# EAGLE design Moodlight20_ETP2 (EAGLE 9.5.0)

## Sheet 1 of 2
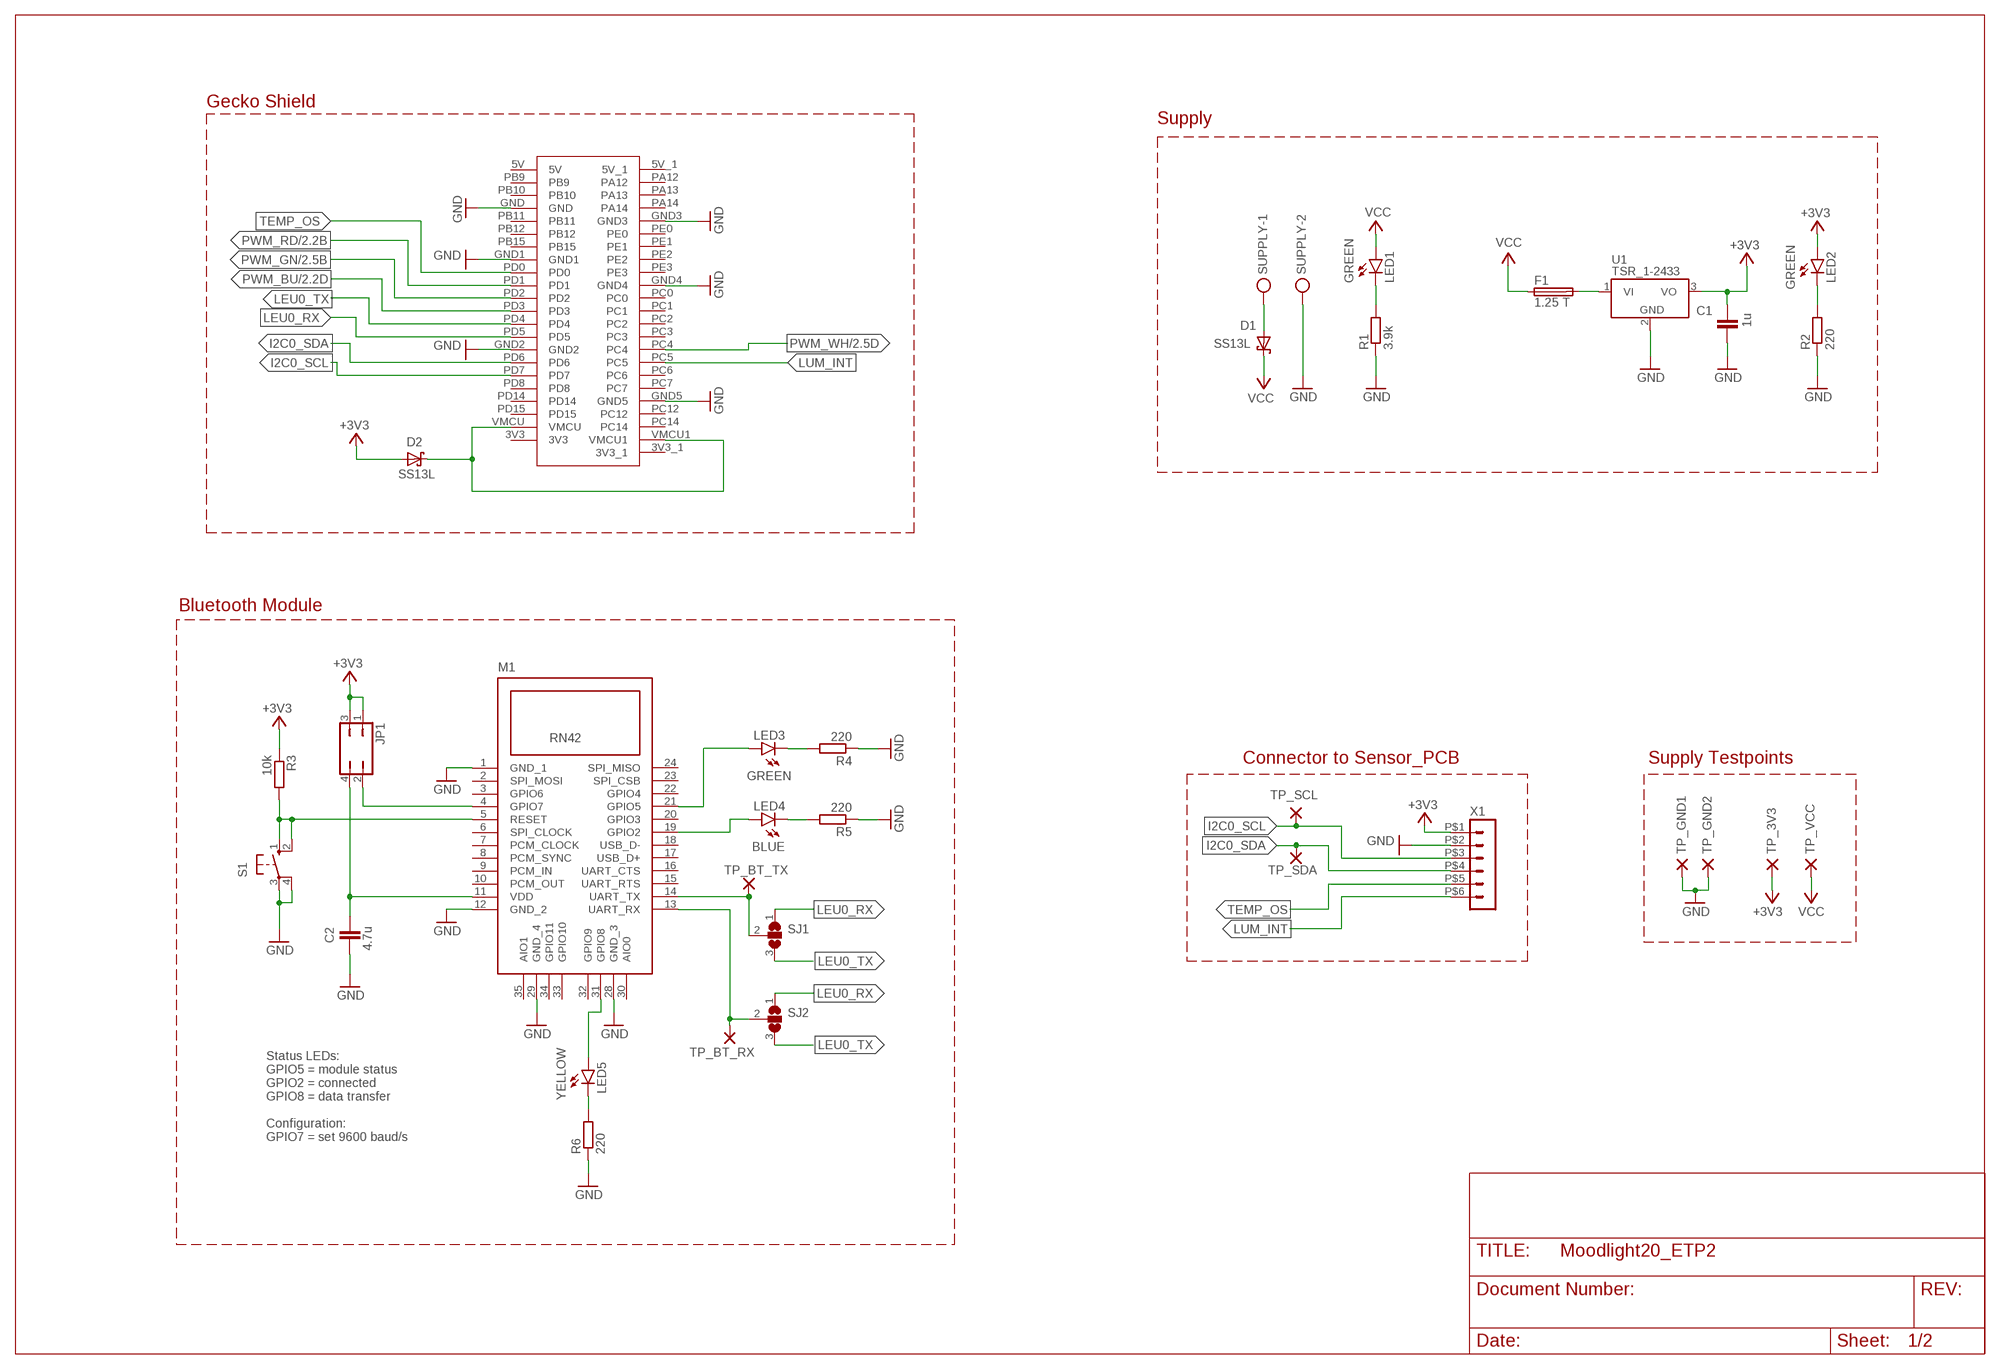
[diagram p0: schematic, sheet 1]

### Parts
C1  1u  C-EUC0805K  [C0805K]
C2  4.7u  C-EUC0805K  [C0805K]
D1  SS13L  [SUB-SMA]
D2  SS13L  [SUB-SMA]
F1  1.25 T  19560  [19560]
GECKO  GECKO_SHIELD  [GECKO_SHIELD]
JP1  JP2Q  [JP2Q]
LED1  GREEN  LEDCHIP-LED0805  [CHIP-LED0805]
LED2  GREEN  LEDCHIP-LED0805  [CHIP-LED0805]
LED3  GREEN  LEDCHIP-LED0805  [CHIP-LED0805]
LED4  BLUE  LEDCHIP-LED0805  [CHIP-LED0805]
LED5  YELLOW  LEDCHIP-LED0805  [CHIP-LED0805]
M1  RN42_BLUETOOTH  [RN42_BLUETOOTH]
R1  3.9k  R-EU_R0805  [R0805]
R2  220  R-EU_R0805  [R0805]
R3  10k  R-EU_R0805  [R0805]
R4  220  R-EU_R0805  [R0805]
R5  220  R-EU_R0805  [R0805]
R6  220  R-EU_R0805  [R0805]
S1  10-XX  [B3F-10XX]
SJ1  SJ2W  [SJ_2]
SJ2  SJ2W  [SJ_2]
SUPPLY  MKDSN1,5/2-5,08  [MKDSN1,5/2-5,08]
TP_3V3  TESTPOINT  [3,2/1,6]
TP_BT_RX  TESTPOINT  [3,2/1,6]
TP_BT_TX  TESTPOINT  [3,2/1,6]
TP_GND1  TESTPOINT  [3,2/1,6]
TP_GND2  TESTPOINT  [3,2/1,6]
TP_SCL  TESTPOINT  [3,2/1,6]
TP_SDA  TESTPOINT  [3,2/1,6]
TP_VCC  TESTPOINT  [3,2/1,6]
U1  TSR_1-2433  [TSR-1]
X1  HEADER_POS6_43045-0612  [43045-0612]

### Nets
+3V3: C1.1 D2.A JP1.1 JP1.3 LED2.A R3.1 TP_3V3.1(P) U1.3(VO) X1.P$1
A1: D1.A SUPPLY.1
GND: C1.2 C2.1 GECKO.GND GECKO.GND1 GECKO.GND2 GECKO.GND3 GECKO.GND4 GECKO.GND5 M1.1(GND_1) M1.12(GND_2) M1.28(GND_3) M1.29(GND_4) R1.1 R2.1 R4.1 R5.1 R6.1 S1.3(P) S1.4(P1) SUPPLY.2 TP_GND1.1(P) TP_GND2.1(P) U1.2(GND) X1.P$2 ; also sheet 2
I2C0_SCL: GECKO.PD7 TP_SCL.1(P) X1.P$3
I2C0_SDA: GECKO.PD6 TP_SDA.1(P) X1.P$4
LEU0_RX: GECKO.PD5 SJ1.1 SJ2.1
LEU0_TX: GECKO.PD4 SJ1.3 SJ2.3
LUM_INT: GECKO.PC5 X1.P$6
N$1: LED2.C R2.2
N$2: D2.C GECKO.VMCU GECKO.VMCU1
N$7: LED1.C R1.2
N$13: JP1.2 M1.4(GPIO7)
N$14: C2.2 JP1.4 M1.11(VDD)
N$22: LED4.C R5.2
N$23: LED4.A M1.19(GPIO2)
N$24: LED3.C R4.2
N$25: LED3.A M1.21(GPIO5)
N$26: LED5.C R6.2
N$27: LED5.A M1.31(GPIO8)
N$28: M1.5(RESET) R3.2 S1.1(S) S1.2(S1)
N$29: M1.14(UART_TX) SJ1.2 TP_BT_TX.1(P)
N$30: M1.13(UART_RX) SJ2.2 TP_BT_RX.1(P)
PWM_BU: GECKO.PD3 ; also sheet 2
PWM_GN: GECKO.PD2 ; also sheet 2
PWM_RD: GECKO.PD1 ; also sheet 2
PWM_WH: GECKO.PC4 ; also sheet 2
TEMP_OS: GECKO.PD0 X1.P$5
VCC: D1.C F1.1 LED1.A TP_VCC.1(P) ; also sheet 2
VI: F1.2 U1.1(VI)
Unconnected: GECKO.3V3 GECKO.3V3_1 GECKO.5V GECKO.5V_1 GECKO.PA12 GECKO.PA13 GECKO.PA14 GECKO.PB9 GECKO.PB10 GECKO.PB11 GECKO.PB12 GECKO.PB15 GECKO.PC0 GECKO.PC1 GECKO.PC2 GECKO.PC3 GECKO.PC6 GECKO.PC7 GECKO.PC12 GECKO.PC14 GECKO.PD8 GECKO.PD14 GECKO.PD15 GECKO.PE0 GECKO.PE1 GECKO.PE2 GECKO.PE3 M1.2(SPI_MOSI) M1.3(GPIO6) M1.6(SPI_CLOCK) M1.7(PCM_CLOCK) M1.8(PCM_SYNC) M1.9(PCM_IN) M1.10(PCM_OUT) M1.15(UART_RTS) M1.16(UART_CTS) M1.17(USB_D+) M1.18(USB_D-) M1.20(GPIO3) M1.22(GPIO4) M1.23(SPI_CSB) M1.24(SPI_MISO) M1.30(AIO0) M1.32(GPIO9) M1.33(GPIO10) M1.34(GPIO11) M1.35(AIO1)

### Notes on the sheet
- Gecko Shield
- Supply
- Bluetooth Module
- Connector to Sensor_PCB | Supply Testpoints
- Status LEDs:
  GPIO5 = module status
  GPIO2 = connected
  GPIO8 = data transfer
  
  Configuration:
  GPIO7 = set 9600 baud/s

## Sheet 2 of 2
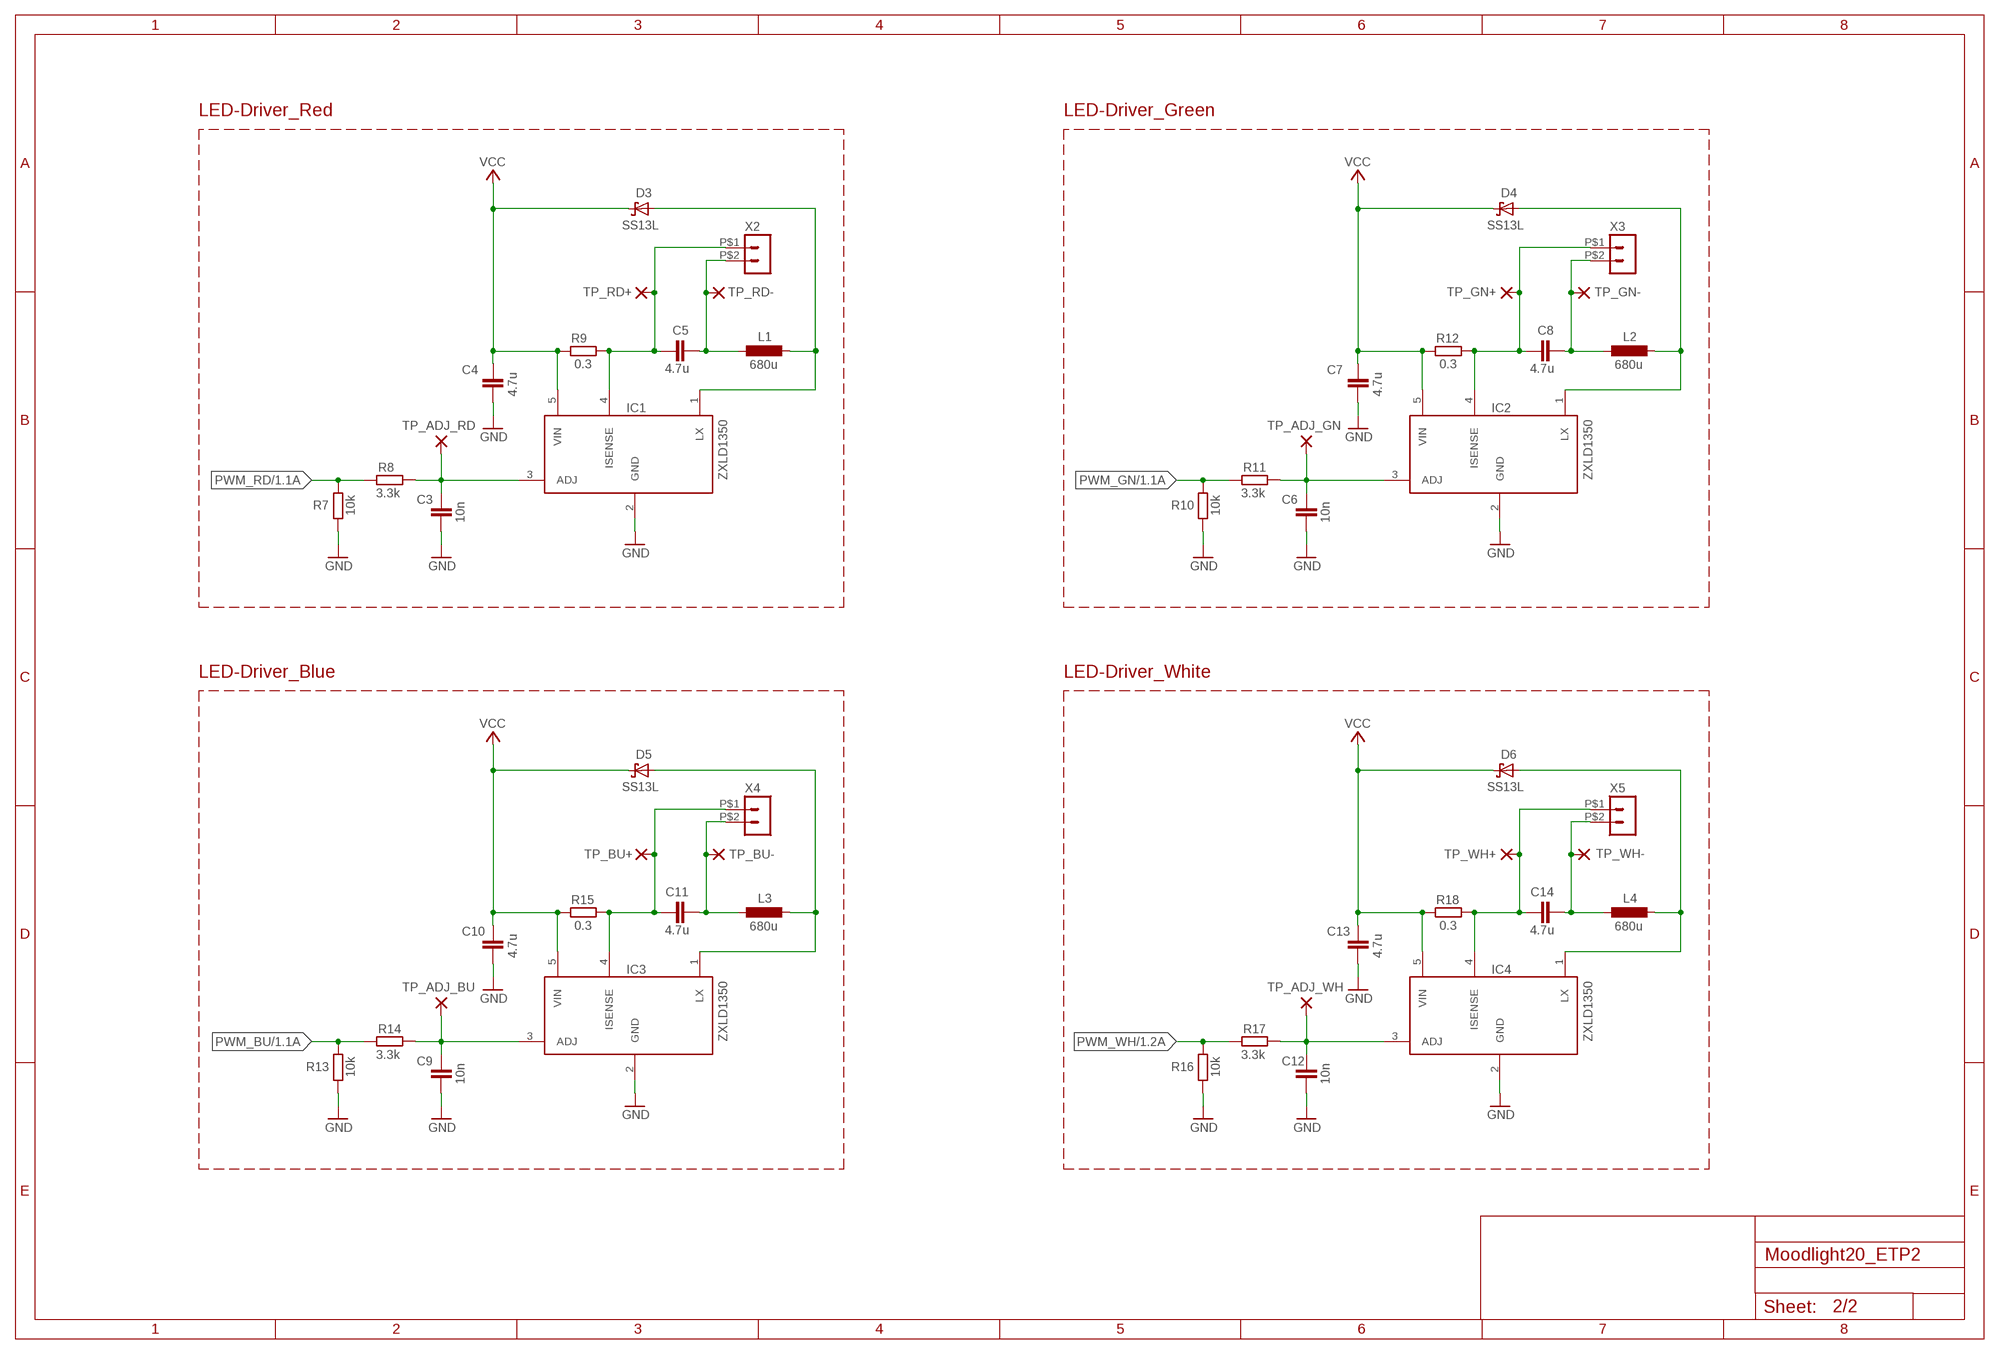
[diagram p1: schematic, sheet 2]

### Parts
C3  10n  C-EUC0805K  [C0805K]
C4  4.7u  C-EUC0805K  [C0805K]
C5  4.7u  C-EUC0805K  [C0805K]
C6  10n  C-EUC0805K  [C0805K]
C7  4.7u  C-EUC0805K  [C0805K]
C8  4.7u  C-EUC0805K  [C0805K]
C9  10n  C-EUC0805K  [C0805K]
C10  4.7u  C-EUC0805K  [C0805K]
C11  4.7u  C-EUC0805K  [C0805K]
C12  10n  C-EUC0805K  [C0805K]
C13  4.7u  C-EUC0805K  [C0805K]
C14  4.7u  C-EUC0805K  [C0805K]
D3  SS13L  [SUB-SMA]
D4  SS13L  [SUB-SMA]
D5  SS13L  [SUB-SMA]
D6  SS13L  [SUB-SMA]
IC1  ZXLD1350  [TSOT23-5L]
IC2  ZXLD1350  [TSOT23-5L]
IC3  ZXLD1350  [TSOT23-5L]
IC4  ZXLD1350  [TSOT23-5L]
L1  680u  POWER-CHOKE_WE-PD  [POWER-CHOKE_WE-PD]
L2  680u  POWER-CHOKE_WE-PD  [POWER-CHOKE_WE-PD]
L3  680u  POWER-CHOKE_WE-PD  [POWER-CHOKE_WE-PD]
L4  680u  POWER-CHOKE_WE-PD  [POWER-CHOKE_WE-PD]
R7  10k  R-EU_R0805  [R0805]
R8  3.3k  R-EU_R0805  [R0805]
R9  0.3  R-EU_R1206  [R1206]
R10  10k  R-EU_R0805  [R0805]
R11  3.3k  R-EU_R0805  [R0805]
R12  0.3  R-EU_R1206  [R1206]
R13  10k  R-EU_R0805  [R0805]
R14  3.3k  R-EU_R0805  [R0805]
R15  0.3  R-EU_R1206  [R1206]
R16  10k  R-EU_R0805  [R0805]
R17  3.3k  R-EU_R0805  [R0805]
R18  0.3  R-EU_R1206  [R1206]
TP_ADJ_BU  TESTPOINT  [3,2/1,6]
TP_ADJ_GN  TESTPOINT  [3,2/1,6]
TP_ADJ_RD  TESTPOINT  [3,2/1,6]
TP_ADJ_WH  TESTPOINT  [3,2/1,6]
TP_BU+  TESTPOINT  [3,2/1,6]
TP_BU-  TESTPOINT  [3,2/1,6]
TP_GN+  TESTPOINT  [3,2/1,6]
TP_GN-  TESTPOINT  [3,2/1,6]
TP_RD+  TESTPOINT  [3,2/1,6]
TP_RD-  TESTPOINT  [3,2/1,6]
TP_WH+  TESTPOINT  [3,2/1,6]
TP_WH-  TESTPOINT  [3,2/1,6]
X2  HEADER_POS2_43650-0215  [43650-0215]
X3  HEADER_POS2_43650-0215  [43650-0215]
X4  HEADER_POS2_43650-0215  [43650-0215]
X5  HEADER_POS2_43650-0215  [43650-0215]

### Nets
GND: C3.2 C4.2 C6.2 C7.2 C9.2 C10.2 C12.2 C13.2 IC1.2(GND) IC2.2(GND) IC3.2(GND) IC4.2(GND) R7.1 R10.1 R13.1 R16.1 ; also sheet 1
LED_R+1: C5.1 IC1.4(ISENSE) R9.2 TP_RD+.1(P) X2.P$1
LED_R+2: C14.1 IC4.4(ISENSE) R18.2 TP_WH+.1(P) X5.P$1
LED_R+3: C8.1 IC2.4(ISENSE) R12.2 TP_GN+.1(P) X3.P$1
LED_R+5: C11.1 IC3.4(ISENSE) R15.2 TP_BU+.1(P) X4.P$1
LED_R-1: C5.2 L1.1 TP_RD-.1(P) X2.P$2
LED_R-2: C14.2 L4.1 TP_WH-.1(P) X5.P$2
LED_R-3: C8.2 L2.1 TP_GN-.1(P) X3.P$2
LED_R-5: C11.2 L3.1 TP_BU-.1(P) X4.P$2
N$4: D3.A IC1.1(LX) L1.2
N$5: C3.1 IC1.3(ADJ) R8.1 TP_ADJ_RD.1(P)
N$6: D6.A IC4.1(LX) L4.2
N$8: C12.1 IC4.3(ADJ) R17.1 TP_ADJ_WH.1(P)
N$9: D4.A IC2.1(LX) L2.2
N$12: C6.1 IC2.3(ADJ) R11.1 TP_ADJ_GN.1(P)
N$17: D5.A IC3.1(LX) L3.2
N$18: C9.1 IC3.3(ADJ) R14.1 TP_ADJ_BU.1(P)
PWM_BU: R13.2 R14.2 ; also sheet 1
PWM_GN: R10.2 R11.2 ; also sheet 1
PWM_RD: R7.2 R8.2 ; also sheet 1
PWM_WH: R16.2 R17.2 ; also sheet 1
VCC: C4.1 C7.1 C10.1 C13.1 D3.C D4.C D5.C D6.C IC1.5(VIN) IC2.5(VIN) IC3.5(VIN) IC4.5(VIN) R9.1 R12.1 R15.1 R18.1 ; also sheet 1

### Notes on the sheet
- LED-Driver_Red | LED-Driver_Green
- LED-Driver_Blue | LED-Driver_White

## Library data of the parts
C1-C14 = rcl:C-EU: CAPACITOR, European symbol; SPICEPREFIX: C
D1-D6 = Moodlight:SS13L: Schottky-Diode 1A/30V
F1 = fuse:19560: FUSE HOLDER TR5, Wickmann; MPN: 56000001009; OC_FARNELL: 1185363; OC_NEWARK: 15P8392
GECKO = Moodlight:GECKO_SHIELD
IC1-IC4 = Moodlight:ZXLD1350: ZXLD1350 30V 350mA LED DRIVER with AEC-Q100
JP1 = jumper:JP2Q: JUMPER
L1-L4 = Moodlight:POWER-CHOKE_WE-PD: POWER-CHOKE_WE-PD
LED1-LED5 = led:LED: LED OSRAM: - CHIPLED LG R971, LG N971, LY N971, LG Q971, LY Q971, LO R971, LY R971 LH N974, LH R974 LS Q976, LO Q976, LY Q976 LO Q996 - Hyper CHIPLED LW Q18S LB Q993, LB Q99A, LB R99A - SideLED LS A670, LO A670, LY A670, LG A670, LP A670 LB A673, LV A673, LT A673, LW A673 LH A674 LY A675 LS A676, LA A676, LO A676, LY A676, LW A676 LS A679, LY A679, LG A679 - Hyper Micro SIDELED® LS Y876, LA Y876, LO Y876, LY Y876 LT Y87S - SmartLED LW L88C, LW L88S LB L89C, LB L89S, LG L890 LS L89K, LO L89K, LY L89K LS L896, LA L896, LO L896, LY L896 - TOPLED LS T670, LO T670, LY T670, LG T670, LP T670 LSG T670, LSP T670, LSY T670, LOP T670, LYG T670 LG T671, LOG T671, LSG T671 LB T673, LV T673, LT T673, LW T673 LH T674 LS T676, LA T676, LO T676, LY T676, LB T676, LH T676, LSB T676, LW T676 LB T67C, LV T67C, LT T67C, LS T67K, LO T67K, LY T67K, LW E67C LS E67B, LA E67B, LO E67B, LY E67B, LB E67C, LV E67C, LT E67C LW T67C LS T679, LY T679, LG T679 LS T770, LO T770, LY T770, LG T770, LP T770 LB T773, LV T773, LT T773, LW T773 LH T774 LS E675, LA E675, LY E675, LS T675 LS T776, LA T776, LO T776, LY T776, LB T776 LHGB T686 LT T68C, LB T68C - Hyper Mini TOPLED® LB M676 - Mini TOPLED Santana® LG M470 LS M47K, LO M47K, LY M47K Source: http://www.osram.convergy.de LUXEON: - LUMILED® LXK2-PW12-R00, LXK2-PW12-S00, LXK2-PW14-U00, LXK2-PW14-V00 LXK2-PM12-R00, LXK2-PM12-S00, LXK2-PM14-U00 LXK2-PE12-Q00, LXK2-PE12-R00, LXK2-PE12-S00, LXK2-PE14-T00, LXK2-PE14-U00 LXK2-PB12-K00, LXK2-PB12-L00, LXK2-PB12-M00, LXK2-PB14-N00, LXK2-PB14-P00, LXK2-PB14-Q00 LXK2-PR12-L00, LXK2-PR12-M00, LXK2-PR14-Q00, LXK2-PR14-R00 LXK2-PD12-Q00, LXK2-PD12-R00, LXK2-PD12-S00 LXK2-PH12-R00, LXK2-PH12-S00 LXK2-PL12-P00, LXK2-PL12-Q00, LXK2-PL12-R00 Source: www.luxeon.com KINGBRIGHT: KA-3528ASYC Source: www.kingbright.com; SPICEPREFIX: L
M1 = Moodlight:RN42_BLUETOOTH: RN42 Bluetooth module
R1-R18 = rcl:R-EU_: RESISTOR, European symbol; SPICEPREFIX: R
S1 = switch-omron:10-XX: OMRON SWITCH; MPN: B3F-1000; OC_FARNELL: 176432; OC_NEWARK: 36M3542
SJ1 SJ2 = jumper:SJ2W: SMD solder JUMPER
SUPPLY = con-phoenix-508:MKDSN1,5/2-5,08: MKDSN 1,5/ 2-5,08 Printklemme Nennstrom: 13,5 A Nennspannung: 250 V Rastermaß: 5,08 mm Polzahl: 2 Anschlussart: Schraubanschluss Montage: Löten Anschlussrichtung Leiter/Platine: 0 ° Artikelnummer: 1729128 Source: http://eshop.phoenixcontact.com .. 1729128.pdf
TP_3V3 TP_ADJ_BU TP_ADJ_GN TP_ADJ_RD TP_ADJ_WH TP_BT_RX TP_BT_TX TP_BU+ TP_BU- TP_GN+ TP_GN- TP_GND1 TP_GND2 TP_RD+ TP_RD- TP_SCL TP_SDA TP_VCC TP_WH+ TP_WH- = Moodlight:TESTPOINT: Testpoint Drill: 1.6mm (dia) Pad: 3.2mm (dia)
U1 = _traco_tsr-1:TSR_1-*: TRACO TSR-1 Series Point-of-Load DC/DC-Converters Vi max. 36 V; Vo = (1.2 .. 15)V ±2%; Io = 0 .. 1 A SIP-Package (drop-in replacement for 78xx linear voltage regulators in TO220-package, vertically assembled) Source: www.tracopower.com Technologies: TSR 1- Vi (V) Vo (V) ±2% Io = 0 .. 1 A 24_ ( generic ) 2412 4.6 .. 36 1.2 2415 4.6 .. 36 1.5 2418 4.6 .. 36 1.8 2425 4.6 .. 36 2.5 2433 4.75.. 36 3.3 2450 6.5 .. 36 5.0 2465 9.0 .. 36 6.5 2490 12 .. 36 9.0 24120 15 .. 36 12 24150 18 .. 36 15 Author: Dipl.-Ing. FH Rainer Bayer HHN Hochschule Heilbronn, rainer.bayer@hs-heilbronn.de Ingenieurbüro ing-rb, mail@ing-rb.de
X1 = con-molex-micro-fit-3_0:HEADER_POS6_?: Molex - Micro-Fit 3.0 Series connector, 3.00mm (0.118") pitch header, 6 positions.
X2-X5 = con-molex-micro-fit-3_0:HEADER_POS2_?: Molex - Micro-Fit 3.0 Series connector, 3.00mm (0.118") pitch header, 2 positions.

## Board
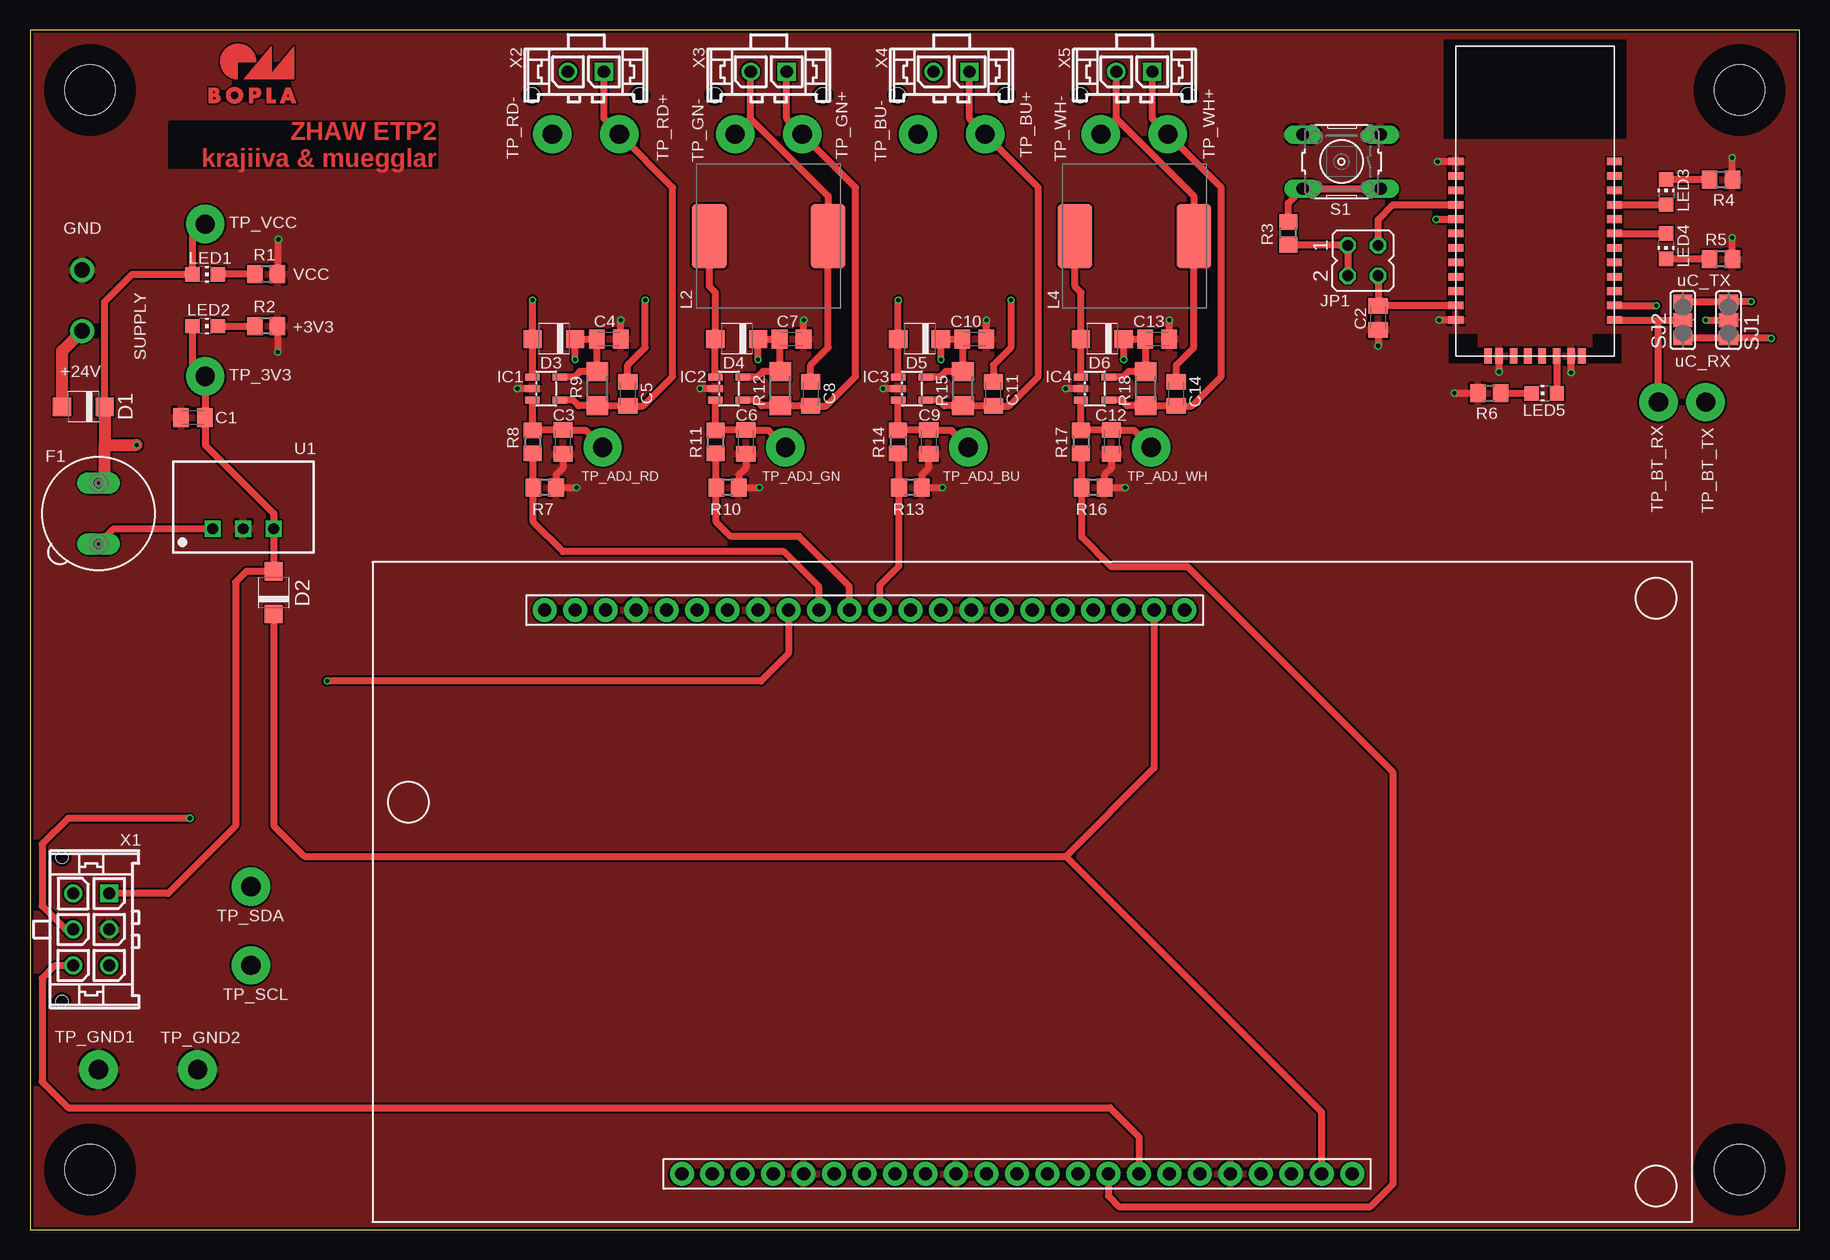
[diagram p2: board, top side]
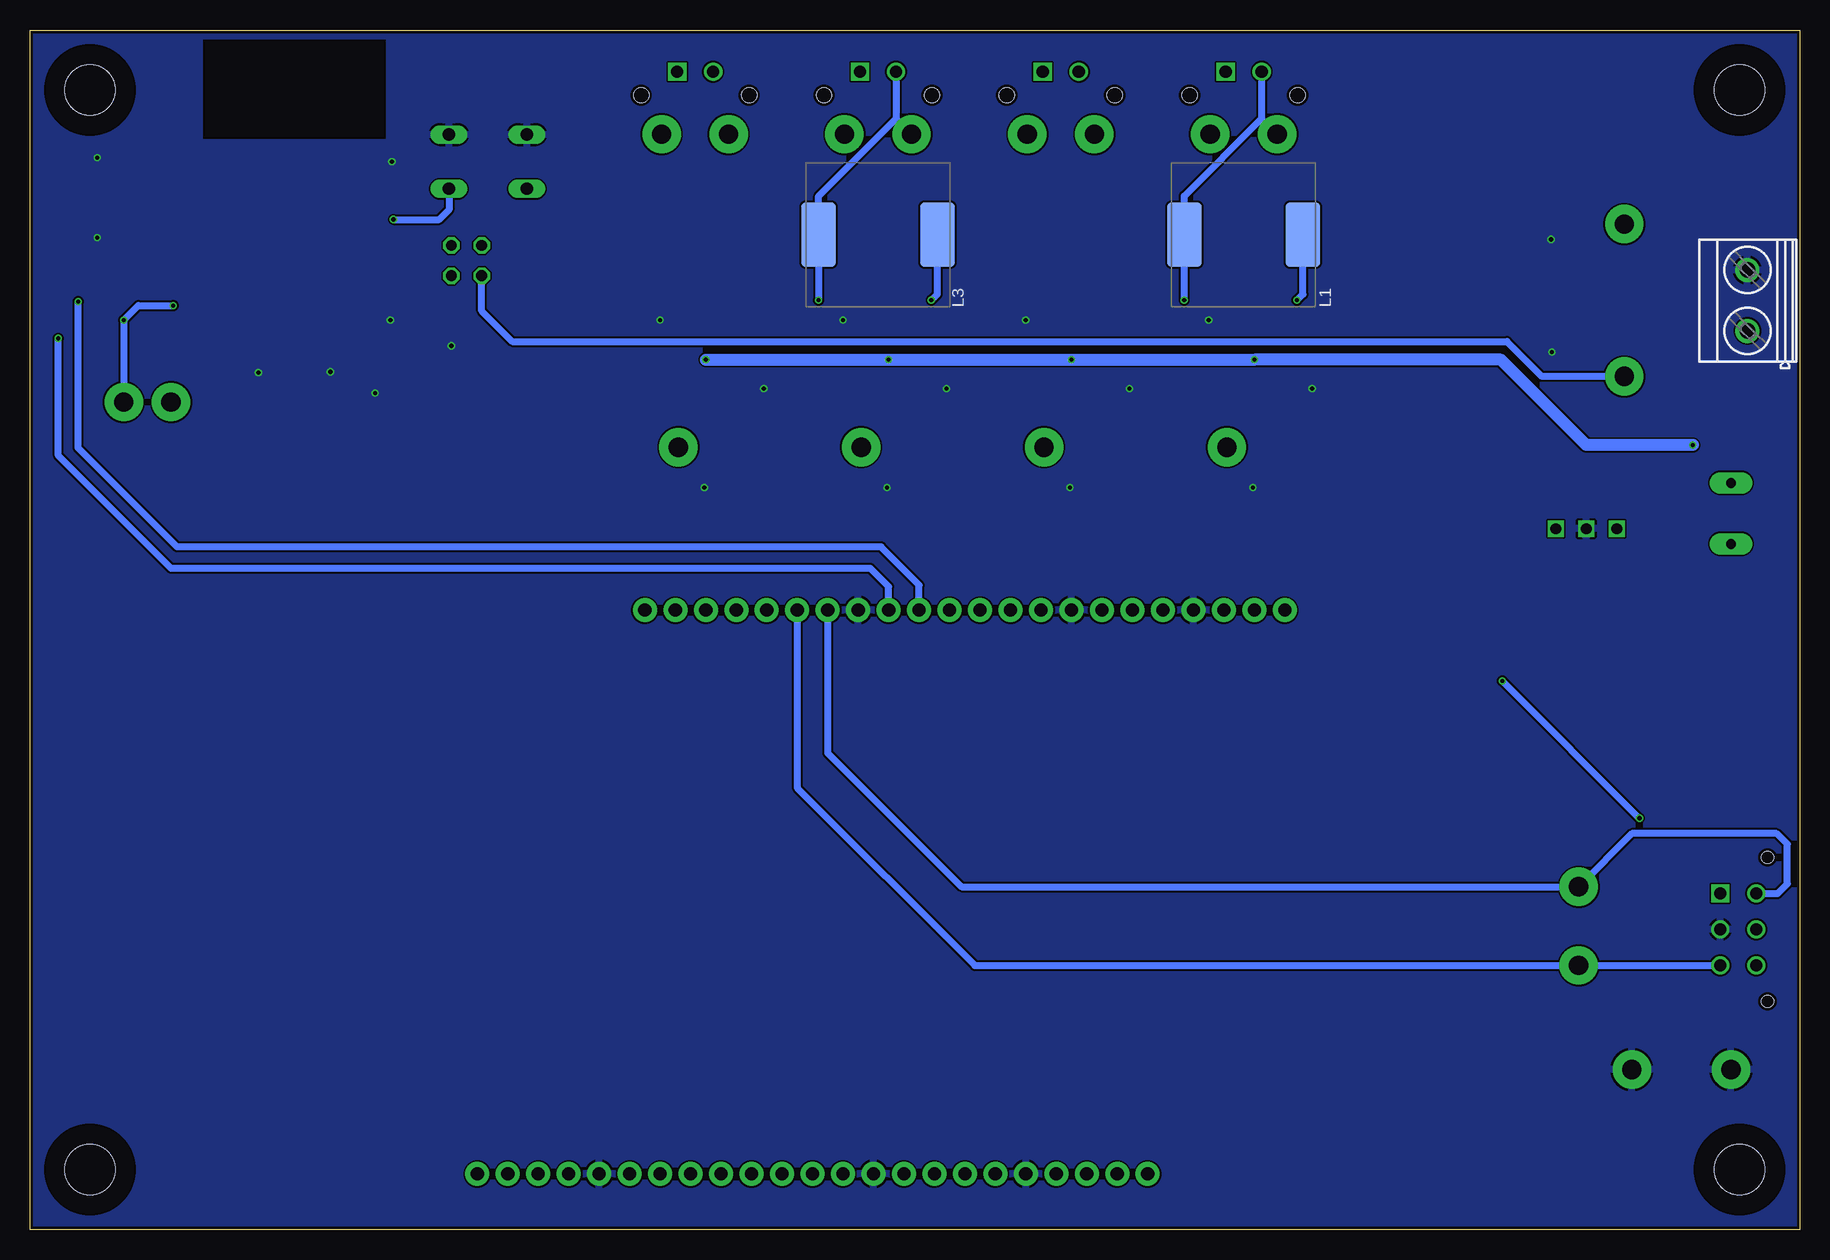
[diagram p3: board, bottom side, seen from below]

Size 147.5 x 100 mm. Coordinates in mm from the lower left corner, seen from the top.
Outline: 0,0 147.5,0 147.5,100 0,100 0,0
Copper layers (1*16): Top 0.018mm / dielectric 1.55mm / Bottom 0.018mm
Design rules "default": minimum track width 0.15mm, minimum drill 0.35mm, track to track 0.15mm, track to pad 0.15mm, pad to pad 0.15mm, via to via 0.15mm, smd to smd 0mil, copper to edge 0.25mm, drill to drill 0.35mm, minimum pad ring 0.175mm, minimum via ring 0.125mm, stop-mask expansion 0mil, vias tented up to drill 0.45mm, thermal gap 0.2mm
Holes 4.2 mm at 5,95 142.5,95 142.5,5 5,5
tRestrict: area 1.2,1.2 to 8.8,8.8; area 138.8,1.2 to 146.2,8.8; area 138.8,91.2 to 146.2,98.8; area 1.2,91.2 to 8.8,98.8
bRestrict: area 1.2,1.2 to 8.8,8.8; area 138.8,1.2 to 146.2,8.8; area 138.8,91.2 to 146.2,98.8; area 1.2,91.2 to 8.8,98.8

### Footprints (pad centres in the part's own frame; a part is rotated, then mirrored left to right if it is on the bottom)
C0805K = smd 1.3 x 1.6: 1 -1,0; 2 1,0
SUB-SMA = smd 1.524 x 1.524: A 1.778,0; C -1.778,0
19560 = drill 0.813 pad 1.778 long: 1 -2.54,0; 2 2.54,0
GECKO_SHIELD = drill 1.1 pad 2: 3V3 67.689,51; 3V3_1 81.659,4; 5V 14.348,51; 5V_1 25.779,4; GND 21.968,51; GND1 32.129,51; GND2 49.908,51; GND3 35.938,4; GND4 48.639,4; GND5 71.499,4; PA12 28.319,4; PA13 30.858,4; PA14 33.398,4; PB9 16.889,51; PB10 19.428,51; PB11 24.509,51; PB12 27.049,51; PB15 29.588,51; PC0 51.178,4; PC1 53.718,4; PC2 56.258,4; PC3 58.798,4; PC4 61.339,4; PC5 63.879,4; PC6 66.418,4; PC7 68.959,4; PC12 74.038,4; PC14 76.579,4; PD0 34.669,51; PD1 37.209,51; PD2 39.748,51; PD3 42.288,51; PD4 44.828,51; PD5 47.368,51; PD6 52.449,51; PD7 54.989,51; PD8 57.529,51; PD14 60.069,51; PD15 62.608,51; PE0 38.478,4; PE1 41.019,4; PE2 43.559,4; PE3 46.099,4; VMCU 65.148,51; VMCU1 79.118,4
TSOT23-5L = smd 0.6 x 1.2: 1 -0.95,-1.15; 2 0,-1.15; 3 0.95,-1.15; 4 0.95,1.15; 5 -0.95,1.15
JP2Q = drill 0.914 octagon: 1 -1.27,-1.27; 2 -1.27,1.27; 3 1.27,-1.27; 4 1.27,1.27
POWER-CHOKE_WE-PD = smd 5.4 x 2.9: 1 0,4.95; 2 0,-4.95
CHIP-LED0805 = smd 1.2 x 1.2: A 0,-1.05; C 0,1.05
RN42_BLUETOOTH = smd 1.27 x 0.635: 1 -6.6,0; 2 -6.6,-1.2; 3 -6.6,-2.4; 4 -6.6,-3.6; 5 -6.6,-4.8; 6 -6.6,-6; 7 -6.6,-7.2; 8 -6.6,-8.4; 9 -6.6,-9.6; 10 -6.6,-10.8; 11 -6.6,-12; 12 -6.6,-13.2; 13 6.6,-13.2; 14 6.6,-12; 15 6.6,-10.8; 16 6.6,-9.6; 17 6.6,-8.4; 18 6.6,-7.2; 19 6.6,-6; 20 6.6,-4.8; 21 6.6,-3.6; 22 6.6,-2.4; 23 6.6,-1.2; 24 6.6,0 | smd 0.635 x 1.27: 28 3,-16.2; 29 -3,-16.2; 30 3.9,-16.2; 31 1.8,-16.2; 32 0.6,-16.2; 33 -0.6,-16.2; 34 -1.8,-16.2; 35 -3.9,-16.2
R0805 = smd 1.3 x 1.5: 1 -0.95,0; 2 0.95,0
R1206 = smd 1.6 x 1.803: 1 -1.422,0; 2 1.422,0
B3F-10XX = drill 1.016 long: 1 -3.251,2.261; 2 3.251,2.261; 3 -3.251,-2.261; 4 3.251,-2.261
SJ_2 = smd 1.168 x 1.6: 1 -1.524,0; 2 0,0; 3 1.524,0
MKDSN1,5/2-5,08 = drill 1.3 pad 2: 1 -2.561,0.025; 2 2.519,0.025
3,2/1,6 = drill 1.6 pad 3.2: 1 0,0
TSR-1 = drill 0.9 square: 1 -2.54,0; 2 0,0; 3 2.54,0
43045-0612 = drill 1.02 square: P$1 3,0 | drill 1.02: P$2 0,0; P$3 -3,0; P$4 3,3; P$5 0,3; P$6 -3,3 | hole 1.02: 6,3.94; -6,3.94
43650-0215 = drill 1.02 square: P$1 1.5,0 | drill 1.02: P$2 -1.5,0 | hole 1.27: 4.5,-1.96; -4.5,-1.96

### Placement (x,y rotation side)
C1  13.59,67.69 180 top
C2  112.38,76.01 90 top
C3  44.43,65.66 270 top
C4  48.24,74.23 0 top
C5  49.83,69.66 90 top
C6  59.67,65.66 270 top
C7  63.48,74.23 0 top
C8  65.07,69.66 90 top
C9  74.91,65.66 270 top
C10  78.72,74.23 0 top
C11  80.31,69.66 90 top
C12  90.15,65.66 270 top
C13  93.96,74.23 0 top
C14  95.55,69.66 90 top
D1  4.45,68.58 180 top
D2  20.32,53.09 90 top
D3  43.67,74.23 180 top
D4  58.91,74.23 180 top
D5  74.15,74.23 180 top
D6  89.39,74.23 180 top
F1  5.71,59.69 270 top
GECKO  28.55,0.64 0 top
IC1  43.03,70.1 270 top
IC2  58.27,70.1 270 top
IC3  73.51,70.1 270 top
IC4  88.75,70.1 270 top
JP1  111.11,80.77 270 top
L1  46.34,82.93 90 bottom
L2  61.58,82.8 270 top
L3  76.81,82.93 90 bottom
L4  92.06,82.8 270 top
LED1  14.61,79.63 270 top
LED2  14.61,75.31 270 top
LED3  136.38,86.49 0 top
LED4  136.38,81.98 180 top
LED5  126.22,69.72 90 top
M1  125.46,89.03 0 top
R1  19.68,79.63 180 top
R2  19.68,75.31 180 top
R3  104.88,83.06 90 top
R4  140.95,87.5 180 top
R5  140.95,80.9 180 top
R6  121.65,69.72 0 top
R7  42.91,61.85 180 top
R8  41.89,65.66 270 top
R9  47.29,70.1 270 top
R10  58.15,61.85 180 top
R11  57.13,65.66 270 top
R12  62.53,70.1 270 top
R13  73.39,61.85 180 top
R14  72.37,65.66 270 top
R15  77.77,70.1 270 top
R16  88.63,61.85 180 top
R17  87.61,65.66 270 top
R18  93.01,70.1 270 top
S1  109.33,89.03 180 top
SJ1  141.59,75.82 90 top
SJ2  137.78,75.82 90 top
SUPPLY  4.32,77.47 90 bottom
TP_3V3  14.61,71.12 270 top
TP_ADJ_BU  78.21,65.21 90 top
TP_ADJ_GN  62.97,65.21 90 top
TP_ADJ_RD  47.73,65.21 90 top
TP_ADJ_WH  93.45,65.21 90 top
TP_BT_RX  135.74,68.98 180 top
TP_BT_TX  139.68,68.98 180 top
TP_BU+  79.61,91.31 90 top
TP_BU-  74.02,91.31 90 top
TP_GN+  64.37,91.31 90 top
TP_GN-  58.78,91.31 90 top
TP_GND1  5.71,13.34 0 top
TP_GND2  13.97,13.34 0 top
TP_RD+  49.13,91.31 90 top
TP_RD-  43.54,91.31 90 top
TP_SCL  18.41,22.02 0 top
TP_SDA  18.41,28.57 0 top
TP_VCC  14.61,83.82 270 top
TP_WH+  94.85,91.31 90 top
TP_WH-  89.26,91.31 90 top
U1  17.78,58.42 0 top
X1  6.6,25.02 90 top
X2  46.34,96.52 0 top
X3  61.58,96.52 0 top
X4  76.81,96.52 0 top
X5  92.06,96.52 0 top

### Tracks (layer width: path | path; a pad name or v marks a point on that pad's centre or on a via)
+3V3
  Top 0.3: 104.95,82.04 R3.1
  Top 0.6: LED2.A 13.55,72.17 TP_3V3.1 14.61,67.71 C1.1 14.61,67.67 14.61,65.41 20.32,59.69 U1.3 D2.A 18.03,54.86 17.14,53.98 17.14,33.66 11.51,28.02 X1.P$1 | 104.95,82.04 JP1.1 JP1.3
  Bottom 0.6: TP_3V3.1 21.46,71.12 24.38,74.04 107.3,74.04 109.83,76.58 JP1.3
A1
  Top 1: D1.A 2.67,73.23 SUPPLY.1
GND  (via drill 0.35)
  Top 0.6: v45.57,61.85 R7.1 43.86,62.93 44.43,63.5 C3.2 | C4.2 49.24,75.8 v49.26,75.82 | IC1.2 v40.62,70.1 | v60.81,61.85 R10.1 59.1,62.93 59.67,63.5 C6.2 | C7.2 64.48,75.8 v64.5,75.82 | IC2.2 v55.86,70.1 | v76.05,61.85 R13.1 74.34,62.93 74.91,63.5 C9.2 | C10.2 79.72,75.8 v79.74,75.82 | IC3.2 v71.1,70.1 | v91.29,61.85 R16.1 89.58,62.93 90.15,63.5 C12.2 | C13.2 94.96,75.8 v94.98,75.82 | IC4.2 v86.34,70.1 | v141.9,82.68 v141.9,82.67 R5.1 | R4.1 v141.9,89.34 | M1.1 v117.33,89.03 | R1.1 20.7,79.69 v20.7,82.55 | C2.1 v112.38,73.66 | M1.12 117.46,75.83 v117.45,75.82 | M1.28 v128.46,71.44 | M1.29 v122.46,71.5 | v118.72,69.72 R6.1 | R2.1 v20.64,73.15
  pour Bottom: -0.66,100.97 -0.66,0 -0.02,-0.64 147.3,-0.64 148.57,0.64 148.57,99.69 147.3,100.97
  pour Top: -0.66,100.97 -0.66,0 -0.02,-0.64 147.3,-0.64 148.57,0.64 148.57,99.69 147.3,100.97
I2C0_SCL
  Bottom 0.6: GECKO.PD7 83.54,38.1 83.54,37.84 83.54,36.83 68.73,22.02 TP_SCL.1 X1.P$3
I2C0_SDA
  Bottom 0.6: X1.P$4 1.83,28.02 1.02,28.83 1.02,32.13 1.91,33.02 13.97,33.02 TP_SDA.1 69.85,28.57 81,39.73 GECKO.PD6
LED_R+1
  Top 0.6: IC1.4 45.25,69.15 45.73,68.68 R9.2 49.8,68.68 C5.1 51.11,68.66 53.57,71.12 53.57,86.87 TP_RD+.1 47.84,92.61 X2.P$1
LED_R+2
  Top 0.6: IC4.4 90.97,69.15 91.44,68.68 R18.2 95.53,68.68 C14.1 96.83,68.66 99.29,71.12 99.29,86.87 TP_WH+.1 93.56,92.61 X5.P$1
LED_R+3
  Top 0.6: IC2.4 60.49,69.15 60.97,68.68 R12.2 65.05,68.68 C8.1 66.35,68.66 68.81,71.12 68.81,86.87 TP_GN+.1 63.08,92.61 X3.P$1
LED_R+5
  Top 0.6: IC3.4 75.73,69.15 76.2,68.68 R15.2 80.28,68.68 C11.1 81.59,68.66 84.05,71.12 84.05,86.87 TP_BU+.1 78.31,92.61 X4.P$1
LED_R-1  (via drill 0.35)
  Top 0.6: C5.2 49.83,72.07 51.28,73.53 v51.28,77.47
  Bottom 0.6: X2.P$2 44.84,92.61 | 44.84,92.61 TP_RD-.1 | 44.84,92.61 51.28,86.16 L1.1 v51.28,77.47
LED_R-2
  Top 0.6: C14.2 95.55,72.07 97.01,73.53 L4.1 | L4.1 | 90.56,92.61 X5.P$2 | 90.56,92.61 97.01,86.15 L4.1 | TP_WH-.1 90.56,92.61
LED_R-3
  Top 0.6: C8.2 65.07,72.07 66.53,73.53 L2.1 | L2.1 | 60.08,92.61 X3.P$2 | 60.08,92.61 66.53,86.15 L2.1 | TP_GN-.1 60.08,92.61
LED_R-5  (via drill 0.35)
  Top 0.6: C11.2 80.31,72.07 81.77,73.53 v81.77,77.47
  Bottom 0.6: v81.77,77.47 L3.1 81.77,86.16 75.31,92.61 | X4.P$2 75.31,92.61 | 75.31,92.61 TP_BU-.1
LEU0_RX  (via drill 0.35)
  Top 0.6: SJ2.1 SJ1.1 v145.14,74.3
  Bottom 0.6: GECKO.PD5 75.92,53.59 77.45,55.12 135.74,55.12 145.14,64.52 v145.14,74.3
LEU0_TX  (via drill 0.35)
  Top 0.6: v143.49,77.34 SJ1.3 SJ2.3
  Bottom 0.6: GECKO.PD4 73.38,53.72 76.56,56.9 135.24,56.9 143.49,65.15 v143.49,77.34
LUM_INT
  Top 0.6: GECKO.PC5 92.43,7.75 90.02,10.16 3.17,10.16 1.02,12.32 1.02,20.95 2.08,22.02 X1.P$6
N$1
  Top 0.6: LED2.C R2.2
N$2
  Top 0.6: D2.C 20.32,33.66 22.86,31.11 86.34,31.11 | GECKO.VMCU 93.7,38.48 86.34,31.11 | GECKO.VMCU1 107.67,9.78 86.34,31.11
N$4  (via drill 0.35)
  Top 0.6: IC1.1 D3.A v41.89,77.47
  Bottom 0.6: v41.89,77.47 41.38,77.97 L1.2
N$5
  Top 0.6: IC1.3 R8.1 41.94,66.66 C3.1 44.38,66.61 46.34,66.61 TP_ADJ_RD.1
N$6
  Top 0.6: IC4.1 D6.A 87.61,78.11 87.11,78.61 L4.2
N$7
  Top 0.6: R1.2 LED1.C
N$8
  Top 0.6: IC4.3 R17.1 87.66,66.66 C12.1 90.1,66.61 92.06,66.61 TP_ADJ_WH.1
N$9
  Top 0.6: IC2.1 D4.A 57.13,78.11 56.62,78.61 L2.2
N$12
  Top 0.6: IC2.3 R11.1 57.18,66.66 C6.1 59.62,66.61 61.58,66.61 TP_ADJ_GN.1
N$13
  Top 0.6: JP1.2 112.38,84.2 113.6,85.43 M1.4
N$14
  Top 0.3: 112.39,77.03 C2.2
  Top 0.6: JP1.4 112.39,79.48 112.39,77.03 M1.11
N$17  (via drill 0.35)
  Top 0.6: IC3.1 D5.A v72.37,77.47
  Bottom 0.6: v72.37,77.47 71.86,77.97 L3.2
N$18
  Top 0.6: IC3.3 R14.1 72.42,66.66 C9.1 74.86,66.61 76.82,66.61 TP_ADJ_BU.1
N$22
  Top 0.6: LED4.C 139.97,80.93 R5.2
N$23
  Top 0.6: M1.19 LED4.A
N$24
  Top 0.6: R4.2 136.41,87.5 LED3.C
N$25
  Top 0.6: M1.21 136.37,85.43 LED3.A
N$26
  Top 0.6: R6.2 LED5.C
N$27
  Top 0.6: M1.31 127.26,69.73 LED5.A
N$28  (via drill 0.35)
  Top 0.6: R3.2 104.88,85.57 S1.2 S1.1 | v117.2,84.2 117.23,84.23 M1.5
  Bottom 0.6: S1.1 112.58,85.01 113.39,84.2 v117.2,84.2
N$29  (via drill 0.35)
  Top 0.6: M1.14 v135.55,77.03 | v139.68,75.82 SJ1.2
  Bottom 0.6: TP_BT_TX.1 v139.68,75.82 138.48,77.03 v135.55,77.03
N$30
  Top 0.6: M1.13 135.74,75.83 | 135.74,75.83 SJ2.2 | TP_BT_RX.1 135.74,75.83
PWM_BU
  Top 0.6: R14.2 72.44,64.64 R13.2 72.44,55.31 70.84,53.72 GECKO.PD3
PWM_GN
  Top 0.6: R11.2 57.2,64.64 R10.2 57.2,58.99 58.4,57.78 64.11,57.78 68.3,53.6 GECKO.PD2
PWM_RD
  Top 0.6: R8.2 41.96,64.64 R7.2 41.96,58.99 44.43,56.52 62.84,56.52 65.76,53.6 GECKO.PD1
PWM_WH
  Top 0.6: R17.2 87.68,64.64 R16.2 87.68,57.72 90.15,55.24 96.5,55.24 113.64,38.1 113.64,3.81 111.74,1.91 90.78,1.91 89.89,2.8 GECKO.PC4
TEMP_OS  (via drill 0.35)
  Top 0.6: GECKO.PD0 63.22,48 60.94,45.72 v24.77,45.72 | v13.34,34.29 3.17,34.29 1.02,32.13 1.02,26.97 2.97,25.02 X1.P$5
  Bottom 0.6: v24.77,45.72 v13.34,34.29
VCC  (via drill 0.35)
  Top 0.6: IC1.5 45.38,71.05 45.85,71.53 R9.1 47.29,74.18 C4.1 D3.C v45.45,72.52 | IC2.5 60.62,71.05 61.09,71.53 R12.1 62.53,74.18 C7.1 D4.C v60.69,72.52 | IC3.5 75.86,71.05 76.33,71.53 R15.1 77.77,74.18 C10.1 D5.C v75.93,72.52 | IC4.5 91.1,71.05 91.57,71.53 R18.1 93.01,74.18 C13.1 D6.C v91.17,72.52 | D1.C 6.22,77.34 8.51,79.63 LED1.A 13.55,82.77 TP_VCC.1
  Top 1: D1.C 6.22,65.41 | 6.22,65.41 6.22,62.74 F1.1 | 6.22,65.41 v8.89,65.41
  Bottom 1: v91.17,72.52 v75.93,72.52 v60.69,72.52 v45.45,72.52 24.89,72.52 17.78,65.41 v8.89,65.41
VI
  Top 0.6: F1.2 6.99,58.42 U1.1
(copper drawn outside any net)
  shapes: Top area x1444

### Text on the board
Top: ZHAW ETP2 / krajiiva & muegglar
tNames: GND | VCC | uC_TX | +3V3 | uC_RX | +24V